# Altium schematic sheet 驱动板.SchDoc
size A4
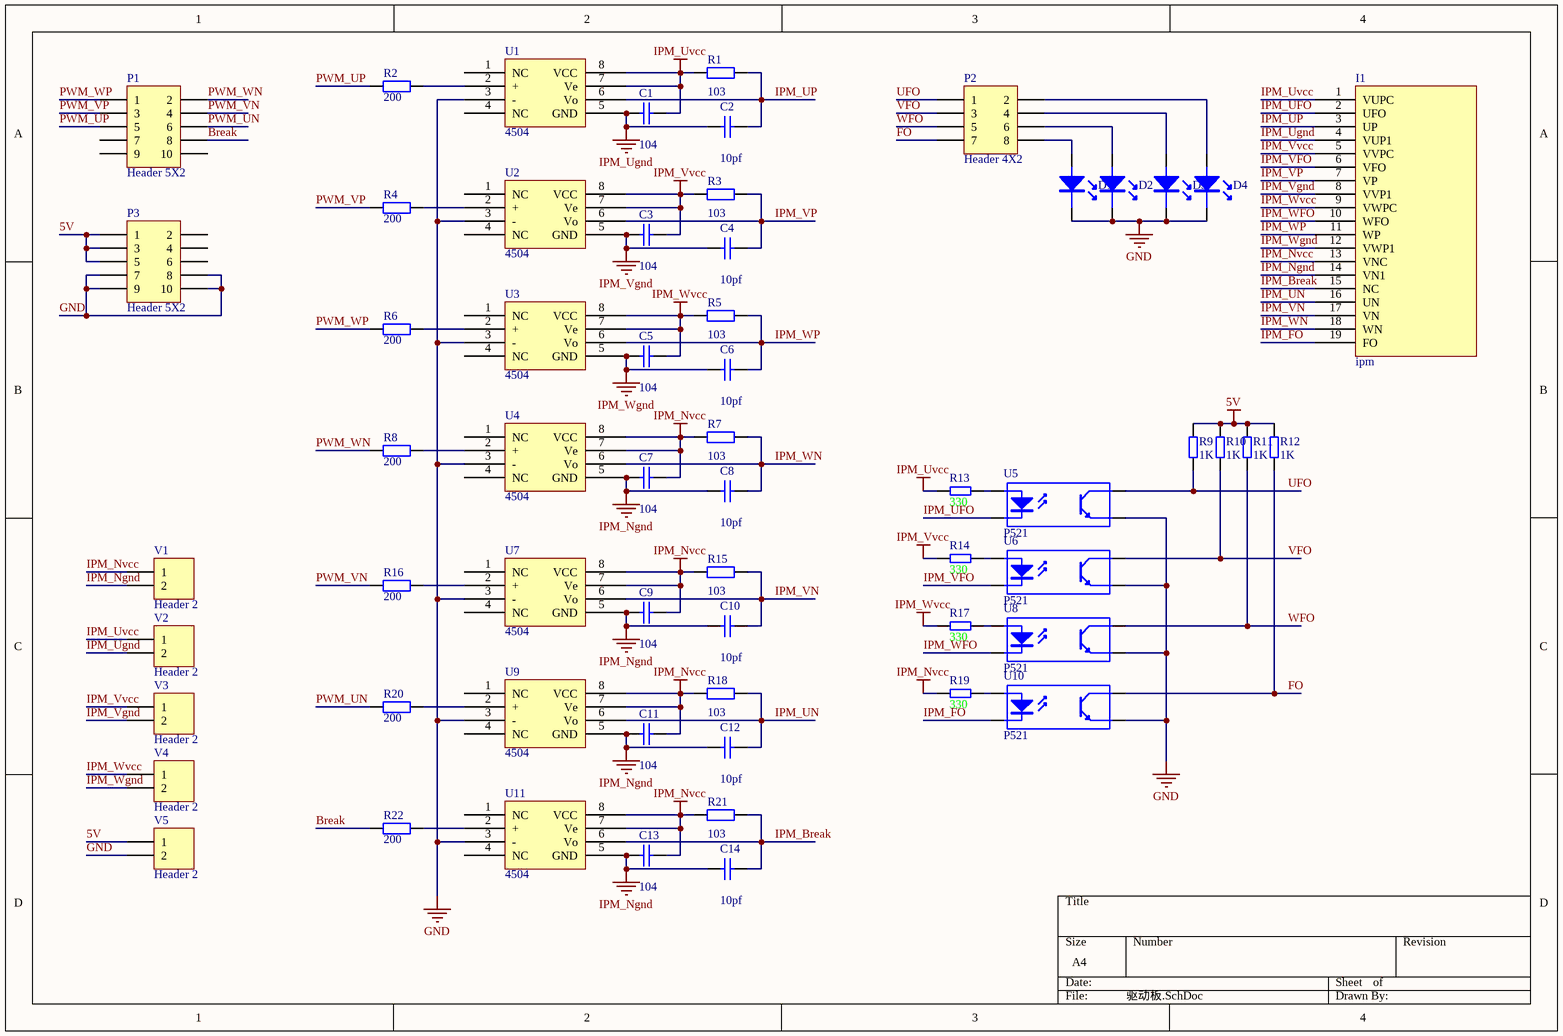
[diagram p0: 驱动板.SchDoc]

## Parts
C1  value 104  [C0805]  (hidden comment: Cap)
C2  value 10pf  [C0805]  (hidden comment: Cap)
C3  value 104  [C0805]  (hidden comment: Cap)
C4  value 10pf  [C0805]  (hidden comment: Cap)
C5  value 104  [C0805]  (hidden comment: Cap)
C6  value 10pf  [C0805]  (hidden comment: Cap)
C7  value 104  [C0805]  (hidden comment: Cap)
C8  value 10pf  [C0805]  (hidden comment: Cap)
C9  value 104  [C0805]  (hidden comment: Cap)
C10  value 10pf  [C0805]  (hidden comment: Cap)
C11  value 104  [C0805]  (hidden comment: Cap)
C12  value 10pf  [C0805]  (hidden comment: Cap)
C13  value 104  [C0805]  (hidden comment: Cap)
C14  value 10pf  [C0805]  (hidden comment: Cap)
D1  LED  [3.2X1.6X1.1]  (value not drawn)
D2  LED  [3.2X1.6X1.1]  (value not drawn)
D3  LED  [3.2X1.6X1.1]  (value not drawn)
D4  LED  [3.2X1.6X1.1]  (value not drawn)
I1  ipm  [ipm]
P1  Header 5X2  [HDR2X5]
P2  Header 4X2  [HDR2X4]
P3  Header 5X2  [HDR2X5]
R1  value 103  [6-0805_N]  (hidden comment: Res2)
R2  value 200  [6-0805_N]  (hidden comment: Res2)
R3  value 103  [6-0805_N]  (hidden comment: Res2)
R4  value 200  [6-0805_N]  (hidden comment: Res2)
R5  value 103  [6-0805_N]  (hidden comment: Res2)
R6  value 200  [6-0805_N]  (hidden comment: Res2)
R7  value 103  [6-0805_N]  (hidden comment: Res2)
R8  value 200  [6-0805_N]  (hidden comment: Res2)
R9  value 1K  [6-0805_N]  (hidden comment: Res)
R10  value 1K  [6-0805_N]  (hidden comment: Res)
R11  value 1K  [6-0805_N]  (hidden comment: Res)
R12  value 1K  [6-0805_N]  (hidden comment: Res)
R13  value 330  [6-0805_N]  (hidden comment: Res Pack2)
R14  value 330  [6-0805_N]  (hidden comment: Res)
R15  value 103  [6-0805_N]  (hidden comment: Res2)
R16  value 200  [6-0805_N]  (hidden comment: Res2)
R17  value 330  [6-0805_N]  (hidden comment: Res)
R18  value 103  [6-0805_N]  (hidden comment: Res2)
R19  value 330  [6-0805_N]  (hidden comment: Res)
R20  value 200  [6-0805_N]  (hidden comment: Res2)
R21  value 103  [6-0805_N]  (hidden comment: Res2)
R22  value 200  [6-0805_N]  (hidden comment: Res2)
U1  4504  [DIP-8]
U2  4504  [DIP-8]
U3  4504  [DIP-8]
U4  4504  [DIP-8]
U5  P521  [DIP-4]
U6  P521  [DIP-4]
U7  4504  [DIP-8]
U8  P521  [DIP-4]
U9  4504  [DIP-8]
U10  P521  [DIP-4]
U11  4504  [DIP-8]
V1  Header 2  [HDR1X2]
V2  Header 2  [HDR1X2]
V3  Header 2  [HDR1X2]
V4  Header 2  [HDR1X2]
V5  Header 2  [HDR1X2]

## Nets
5V: P3.1 P3.3 P3.5 R9.1 R10.1 R11.1 R12.1 V5.1
GND: D1.2 D2.2 D3.2 D4.2 P3.7 P3.8 P3.9 P3.10 U1.3(-) U2.3(-) U3.3(-) U4.3(-) U5.3(E) U6.3(E) U7.3(-) U8.3(E) U9.3(-) U10.3(E) U11.3(-) V5.2
IPM_Ngnd: C7.1 C8.1 C9.1 C10.1 C11.1 C12.1 C13.1 C14.1 I1.14(VN1) U4.5(GND) U7.5(GND) U9.5(GND) U11.5(GND) V1.2
IPM_Nvcc: C7.2 C9.2 C11.2 C13.2 I1.13(VNC) R7.1 R15.1 R18.1 R19.2 R21.1 U4.7(Ve) U4.8(VCC) U7.7(Ve) U7.8(VCC) U9.7(Ve) U9.8(VCC) U11.7(Ve) U11.8(VCC) V1.1
IPM_Ugnd: C1.1 C2.1 I1.4(VUP1) U1.5(GND) V2.2
IPM_Uvcc: C1.2 I1.1(VUPC) R1.1 R13.2 U1.7(Ve) U1.8(VCC) V2.1
IPM_Vgnd: C3.1 C4.1 I1.8(VVP1) U2.5(GND) V3.2
IPM_Vvcc: C3.2 I1.5(VVPC) R3.1 R14.2 U2.7(Ve) U2.8(VCC) V3.1
IPM_Wgnd: C5.1 C6.1 I1.12(VWP1) U3.5(GND) V4.2
IPM_Wvcc: C5.2 I1.9(VWPC) R5.1 R17.2 U3.7(Ve) U3.8(VCC) V4.1
Break: P1.8 R22.1
FO: P2.7 R12.2 U10.4(C)
IPM_Break: C14.2 I1.15(NC) R21.2 U11.6(Vo)
IPM_FO: I1.19(FO) U10.2(K)
IPM_UFO: I1.2(UFO) U5.2(K)
IPM_UN: C12.2 I1.16(UN) R18.2 U9.6(Vo)
IPM_UP: C2.2 I1.3(UP) R1.2 U1.6(Vo)
IPM_VFO: I1.6(VFO) U6.2(K)
IPM_VN: C10.2 I1.17(VN) R15.2 U7.6(Vo)
IPM_VP: C4.2 I1.7(VP) R3.2 U2.6(Vo)
IPM_WFO: I1.10(WFO) U8.2(K)
IPM_WN: C8.2 I1.18(WN) R7.2 U4.6(Vo)
IPM_WP: C6.2 I1.11(WP) R5.2 U3.6(Vo)
PWM_UN: P1.6 R20.1
PWM_UP: P1.5 R2.1
PWM_VN: P1.4 R16.1
PWM_VP: P1.3 R4.1
PWM_WN: P1.2 R8.1
PWM_WP: P1.1 R6.1
UFO: P2.1 R9.2 U5.4(C)
VFO: P2.3 R10.2 U6.4(C)
WFO: P2.5 R11.2 U8.4(C)
NetD1_1: D1.1 P2.8
NetD2_1: D2.1 P2.6
NetD3_1: D3.1 P2.4
NetD4_1: D4.1 P2.2
NetR2_2: R2.2 U1.2(+)
NetR4_2: R4.2 U2.2(+)
NetR6_2: R6.2 U3.2(+)
NetR8_2: R8.2 U4.2(+)
NetR13_1: R13.1 U5.1(A)
NetR14_1: R14.1 U6.1(A)
NetR16_2: R16.2 U7.2(+)
NetR17_1: R17.1 U8.1(A)
NetR19_1: R19.1 U10.1(A)
NetR20_2: R20.2 U9.2(+)
NetR22_2: R22.2 U11.2(+)

Not connected (* = marked no-connect by the designer): P1 7 9 10; P3 2 4 6; U1 1(NC) 4(NC); U2 1(NC) 4(NC); U3 1(NC) 4(NC); U4 1(NC) 4(NC); U7 1(NC) 4(NC); U9 1(NC) 4(NC); U11 1(NC) 4(NC)

## Library data of the parts
C1-C14 = Cap: Capacitor; Published: 8-Jun-2000; LatestRevisionDate: 17-Jul-2002; LatestRevisionNote: Re-released for DXP Platform.; PackageReference: RAD-0.3; Publisher: Altium Limited; PackageDescription: Radial Cap, Thru-Hole; 2 Leads; 0.3 in Pin Spacing
P1 P3 = Header 5X2: Header, 5-Pin, Dual row; LatestRevisionDate: 17-Jul-2002; LatestRevisionNote: Re-released for DXP Platform.; Publisher: Altium Limited
P2 = Header 4X2: Header, 4-Pin, Dual row; LatestRevisionDate: 17-Jul-2002; LatestRevisionNote: Re-released for DXP Platform.; Publisher: Altium Limited
R1-R8 R15 R16 R18 R20-R22 = Res2: Resistor; Published: 8-Jun-2000; LatestRevisionDate: 17-Jul-2002; LatestRevisionNote: Re-released for DXP Platform.; PackageReference: AXIAL-0.4; Publisher: Altium Limited; PackageDescription: Axial Device, Thru-Hole; 2 Leads; 0.4 in Pin Spacing
R9-R14 R17 R19 = Res: 电阻
U5 U6 U8 U10 = Optoisolator1: 4-Pin Phototransistor Optocoupler; Published: 24-Mar-1999; LatestRevisionDate: 04-Mar-2005; LatestRevisionNote: Sch pins 3 & 4 Swapped.; DatasheetVersion: Nov-2003; PackageReference: DIP-4; Publisher: Altium Limited
V1-V5 = Header 2: Header, 2-Pin; LatestRevisionDate: 17-Jul-2002; LatestRevisionNote: Re-released for DXP Platform.; Publisher: Altium Limited